# Altium schematic sheet CHILD_BOARD.SchDoc
size B; SheetNumber: 1; SheetTotal: 9
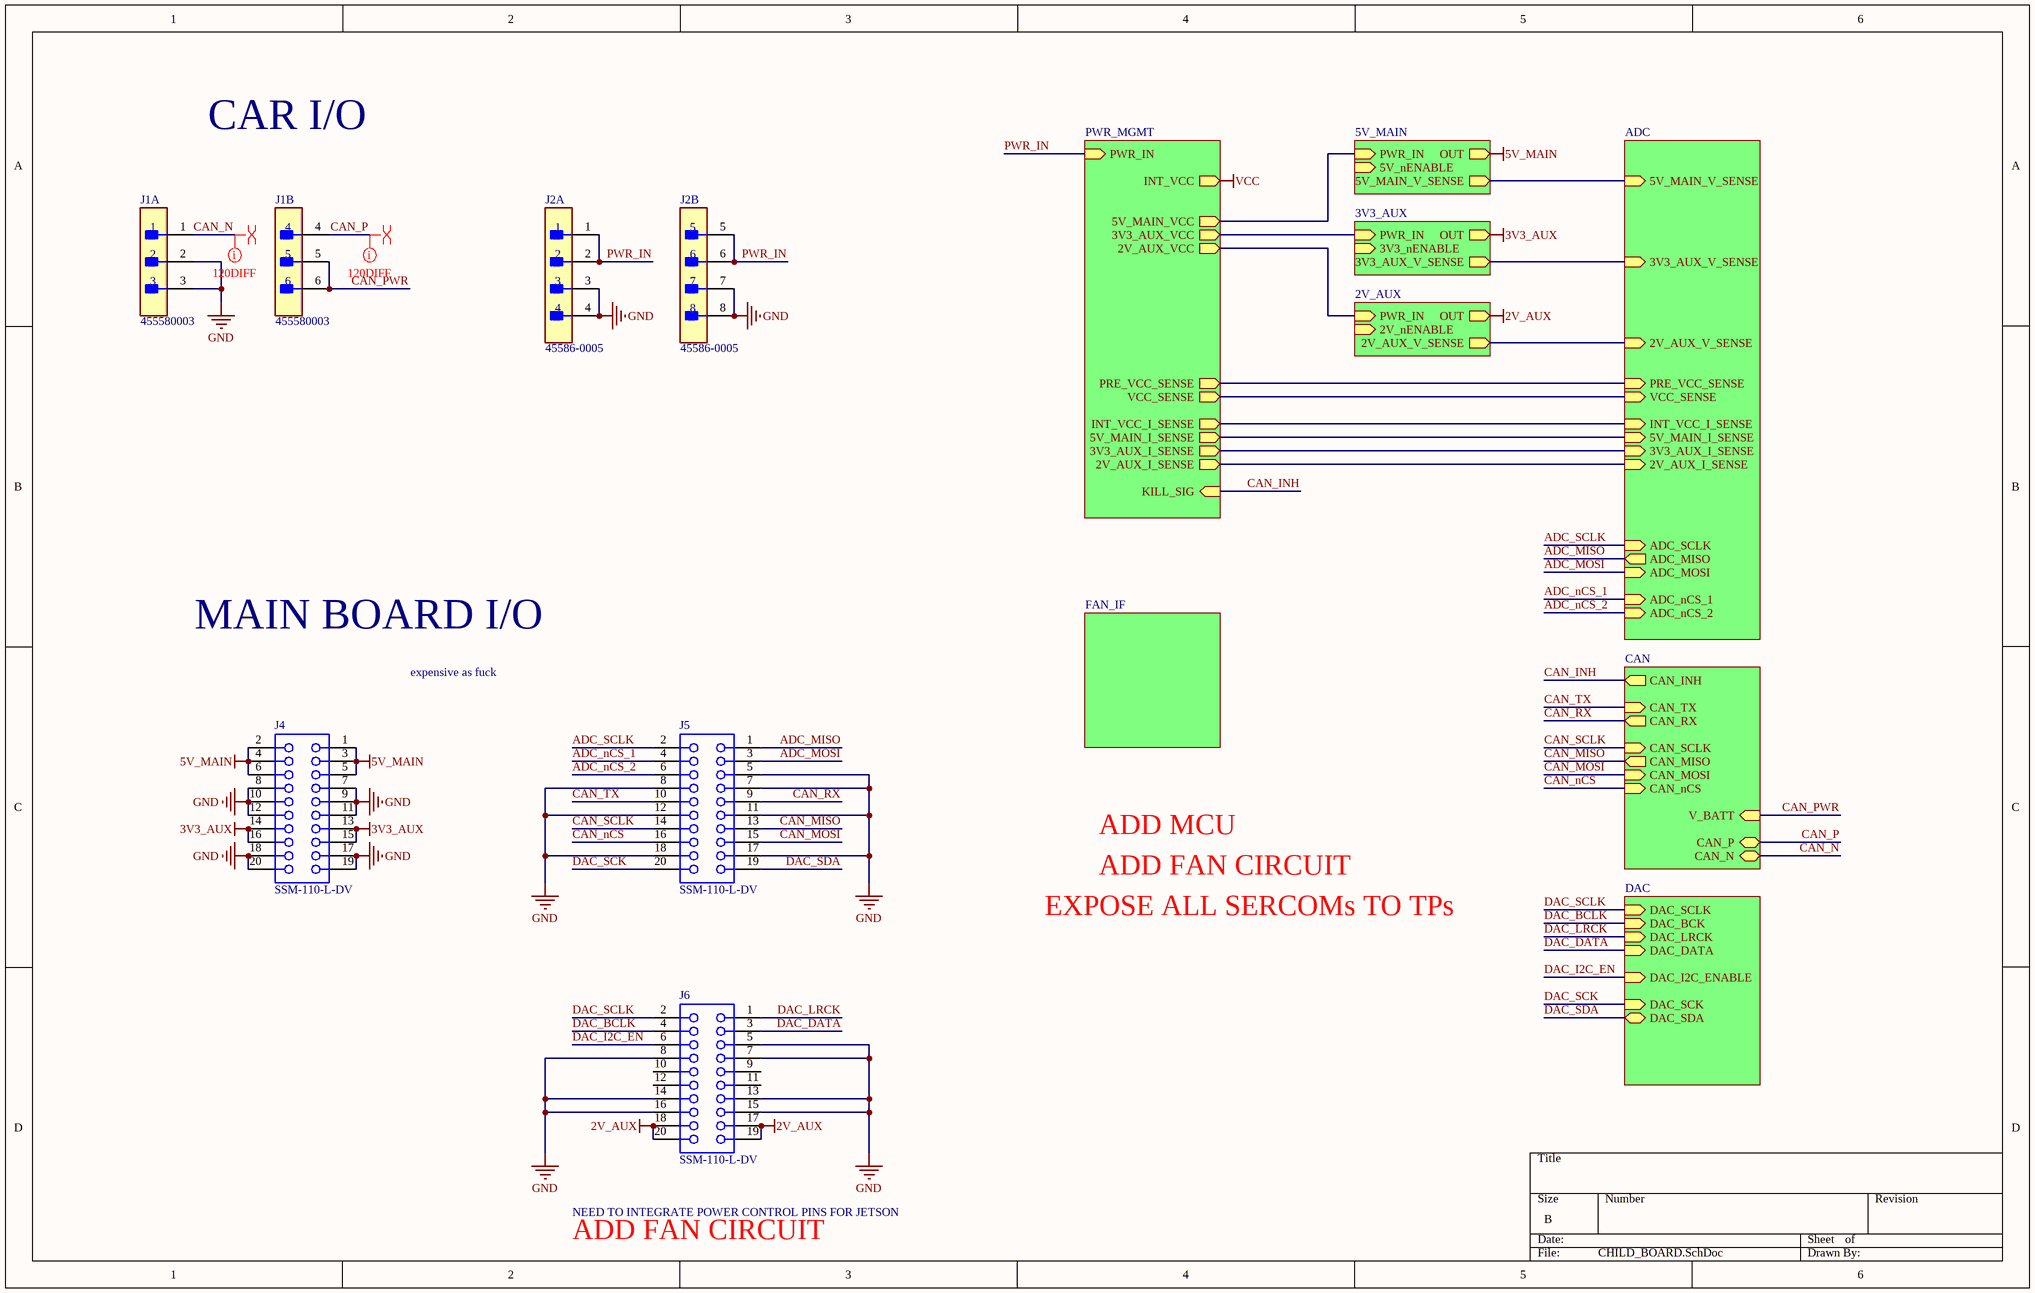
[diagram p0: CHILD_BOARD.SchDoc]

## Parts
J1  455580003  [FP-455580003-MFG]  (parts A,B of 2)
J2  45586-0005  [FP-45586-0005-MFG]  (parts A,B of 2)
J4  SSM-110-L-DV  [SMTC-SSM-110-X-DV]
J5  SSM-110-L-DV  [SMTC-SSM-110-X-DV]
J6  SSM-110-L-DV  [SMTC-SSM-110-X-DV]

## Sub-sheets
3V3_AUX = 3V3_AUX: PWR_IN (in), OUT (out), 3V3_AUX_V_SENSE (out), 3V3_nENABLE (in)
5V_AUX = 2V_AUX: PWR_IN (in), OUT (out), 2V_AUX_V_SENSE (out), 2V_nENABLE (in)
5V_MAIN = 5V_MAIN: PWR_IN (in), OUT (out), 5V_MAIN_V_SENSE (out), 5V_nENABLE (in)
ADC = ADC: 5V_MAIN_V_SENSE (in), 3V3_AUX_V_SENSE (in), INT_VCC_I_SENSE (in), 5V_MAIN_I_SENSE (in), 3V3_AUX_I_SENSE (in), PRE_VCC_SENSE (in), VCC_SENSE (in), ADC_SCLK (in), ADC_MISO (out), ADC_MOSI (in), ADC_nCS_1 (in), ADC_nCS_2 (in), 2V_AUX_I_SENSE (in), 2V_AUX_V_SENSE (in)
CAN = CAN: CAN_TX (in), CAN_RX (out), CAN_SCLK (in), CAN_MISO (out), CAN_MOSI (in), CAN_nCS (in), CAN_INH (out), V_BATT (in), CAN_P (bidir), CAN_N (bidir)
DAC = DAC: DAC_BCK (in), DAC_LRCK (in), DAC_DATA (in), DAC_I2C_ENABLE (in), DAC_SCK (in), DAC_SDA (bidir), DAC_SCLK (in)
FAN_IF = FAN_IF: no entries
PWR_MGMT = PWR_MGMT: PWR_IN (in), INT_VCC (out), 5V_MAIN_VCC (out), 3V3_AUX_VCC (out), PRE_VCC_SENSE (out), VCC_SENSE (out), INT_VCC_I_SENSE (out), 5V_MAIN_I_SENSE (out), 3V3_AUX_I_SENSE (out), KILL_SIG (in), 2V_AUX_VCC (out), 2V_AUX_I_SENSE (out)

## Nets
2V_AUX: J6.17 J6.18 J6.19 J6.20 ; sheet 5V_AUX/OUT
3V3_AUX: J4.13 J4.14 J4.15 J4.16 ; sheet 3V3_AUX/OUT
5V_MAIN: J4.1 J4.2 J4.3 J4.4 J4.5 J4.6 ; sheet 5V_MAIN/OUT
GND: J1.2 J1.3 J2.3 J2.4 J2.7 J2.8 J4.7 J4.8 J4.9 J4.10 J4.11 J4.12 J4.17 J4.18 J4.19 J4.20 J5.5 J5.7 J5.8 J5.11 J5.12 J5.17 J5.18 J6.5 J6.7 J6.8 J6.13 J6.14 J6.15 J6.16
VCC: sheet PWR_MGMT/INT_VCC
ADC_MISO: J5.1 ; sheet ADC/ADC_MISO
ADC_MOSI: J5.3 ; sheet ADC/ADC_MOSI
ADC_nCS_1: J5.4 ; sheet ADC/ADC_nCS_1
ADC_nCS_2: J5.6 ; sheet ADC/ADC_nCS_2
ADC_SCLK: J5.2 ; sheet ADC/ADC_SCLK
CAN_INH: sheet PWR_MGMT/KILL_SIG, sheet CAN/CAN_INH
CAN_MISO: J5.13 ; sheet CAN/CAN_MISO
CAN_MOSI: J5.15 ; sheet CAN/CAN_MOSI
CAN_N: J1.1 ; sheet CAN/CAN_N
CAN_nCS: J5.16 ; sheet CAN/CAN_nCS
CAN_P: J1.4 ; sheet CAN/CAN_P
CAN_PWR: J1.5 J1.6 ; sheet CAN/V_BATT
CAN_RX: J5.9 ; sheet CAN/CAN_RX
CAN_SCLK: J5.14 ; sheet CAN/CAN_SCLK
CAN_TX: J5.10 ; sheet CAN/CAN_TX
DAC_BCLK: J6.4 ; sheet DAC/DAC_BCK
DAC_DATA: J6.3 ; sheet DAC/DAC_DATA
DAC_I2C_EN: J6.6 ; sheet DAC/DAC_I2C_ENABLE
DAC_LRCK: J6.1 ; sheet DAC/DAC_LRCK
DAC_SCK: J5.20 ; sheet DAC/DAC_SCK
DAC_SCLK: J6.2 ; sheet DAC/DAC_SCLK
DAC_SDA: J5.19 ; sheet DAC/DAC_SDA
PWR_IN: J2.1 J2.2 J2.5 J2.6 ; sheet PWR_MGMT/PWR_IN
(unnamed): sheet PWR_MGMT/5V_MAIN_VCC, sheet 5V_MAIN/PWR_IN
(unnamed): sheet PWR_MGMT/3V3_AUX_VCC, sheet 3V3_AUX/PWR_IN
(unnamed): sheet PWR_MGMT/PRE_VCC_SENSE, sheet ADC/PRE_VCC_SENSE
(unnamed): sheet PWR_MGMT/VCC_SENSE, sheet ADC/VCC_SENSE
(unnamed): sheet PWR_MGMT/INT_VCC_I_SENSE, sheet ADC/INT_VCC_I_SENSE
(unnamed): sheet PWR_MGMT/5V_MAIN_I_SENSE, sheet ADC/5V_MAIN_I_SENSE
(unnamed): sheet PWR_MGMT/3V3_AUX_I_SENSE, sheet ADC/3V3_AUX_I_SENSE
(unnamed): sheet PWR_MGMT/2V_AUX_VCC, sheet 5V_AUX/PWR_IN
(unnamed): sheet PWR_MGMT/2V_AUX_I_SENSE, sheet ADC/2V_AUX_I_SENSE
(unnamed): sheet 5V_MAIN/5V_MAIN_V_SENSE, sheet ADC/5V_MAIN_V_SENSE
(unnamed): sheet 5V_AUX/2V_AUX_V_SENSE, sheet ADC/2V_AUX_V_SENSE
(unnamed): sheet 3V3_AUX/3V3_AUX_V_SENSE, sheet ADC/3V3_AUX_V_SENSE

Not connected (* = marked no-connect by the designer): J6 9 10 11 12

## Layout directives
net class 120DIFF: CAN_N, CAN_P
differential pair: CAN_N, CAN_P

## Notes on the sheet
- CAR I/O
- MAIN BOARD I/O
- expensive as fuck
- ADD MCU
- ADD FAN CIRCUIT
- EXPOSE ALL SERCOMs TO TPs
- NEED TO INTEGRATE POWER CONTROL PINS FOR JETSON

## Library data of the parts
J1 = CMP-04776-000024-1: CONN HEADER R/A 6POS 4.2MM; Manufacturer: Molex; Standoff Height: 0.4mm; Conn Orientation: Right Angle; Number Of Contacts: 6; Conn Gender: Male; Voltage Rating: 600V; Current Rating: 8A; Footprint Url: https://www.molex.com/pdm_docs/sd/455580003_sd.pdf; Number Of Rows: 2; Lead Free: Yes; Digikey Description: CONN HEADER R/A 6POS 4.2MM; ComponentLink2URL: https://www.molex.com/webdocs/datasheets/pdf/en-us/0455580003_PCB_HEADERS.pdf; Octopart: https://octopart.com/45558-0003-molex-7672845; Package: 0; Device Class L3: unset; ComponentLink2Description: Datasheet; Device Class L2: Headers and Wire Housings; Category: Conn; Contact Material: Tin,Nickel; Mouser Description: Conn Power HDR 6 POS 4.2mm Solder ST Thru-Hole 6 Terminal 1 Port Mini-Fit Jr™ Tray; Manufacturer Part Number: 455580003; Pitch: 4.2mm; Device Class L1: Connectors; Temperature Range Low: -40°C; Temperature: -40°C to +105°C; RoHS: TRUE; Temperature Range High: +105°C; Height: 10.38mm; Automotive: No
J2 = CMP-04776-000690-1: CONN HEADER R/A 8POS 4.2MM
J4-J6 = CMP-1023-00237-1: Tiger Claw(TM) Surface Mount Socket, Vertical, -55 to 125 degC, 2.54 mm Pitch, 20-Pin, Female, RoHS; Manufacturer: Samtec; Pitch: 2.54 mm; ComponentLink1URL: http://www.samtec.com; ComponentLink1Description: Manufacturer URL; PackageReference: SSM-110-X-DV; RoHS: True; PartNumber: SSM-110-L-DV; ComponentLink3Description: Package Specification; Temperature Range: -55 to 125 degC; PackageDescription: .100 C.L. Double Vertical SMT Socket Strip; ComponentLink2Description: Datasheet; PackageVersion: AK, 3/2000; Mounting Technology: Surface Mount; Orientation: Vertical; ComponentLink2URL: http://www.samtec.com/documents/webfiles/pdf/SSM_SM.PDF; ComponentLink3URL: http://www.samtec.com/documents/webfiles/cpdf/SSM-1XX-XXX-DV-XX-XX-X-XX-MKT.pdf; DatasheetVersion: F-214